# EasyEDA schematic SCH_usb_hub_2024-06-24.json
TITLE: Sheet_1; REV: 1.0; Date: 2024-06-23; Sheet: 1/1; Drawn By: s_nguyen080; Company: Your Company
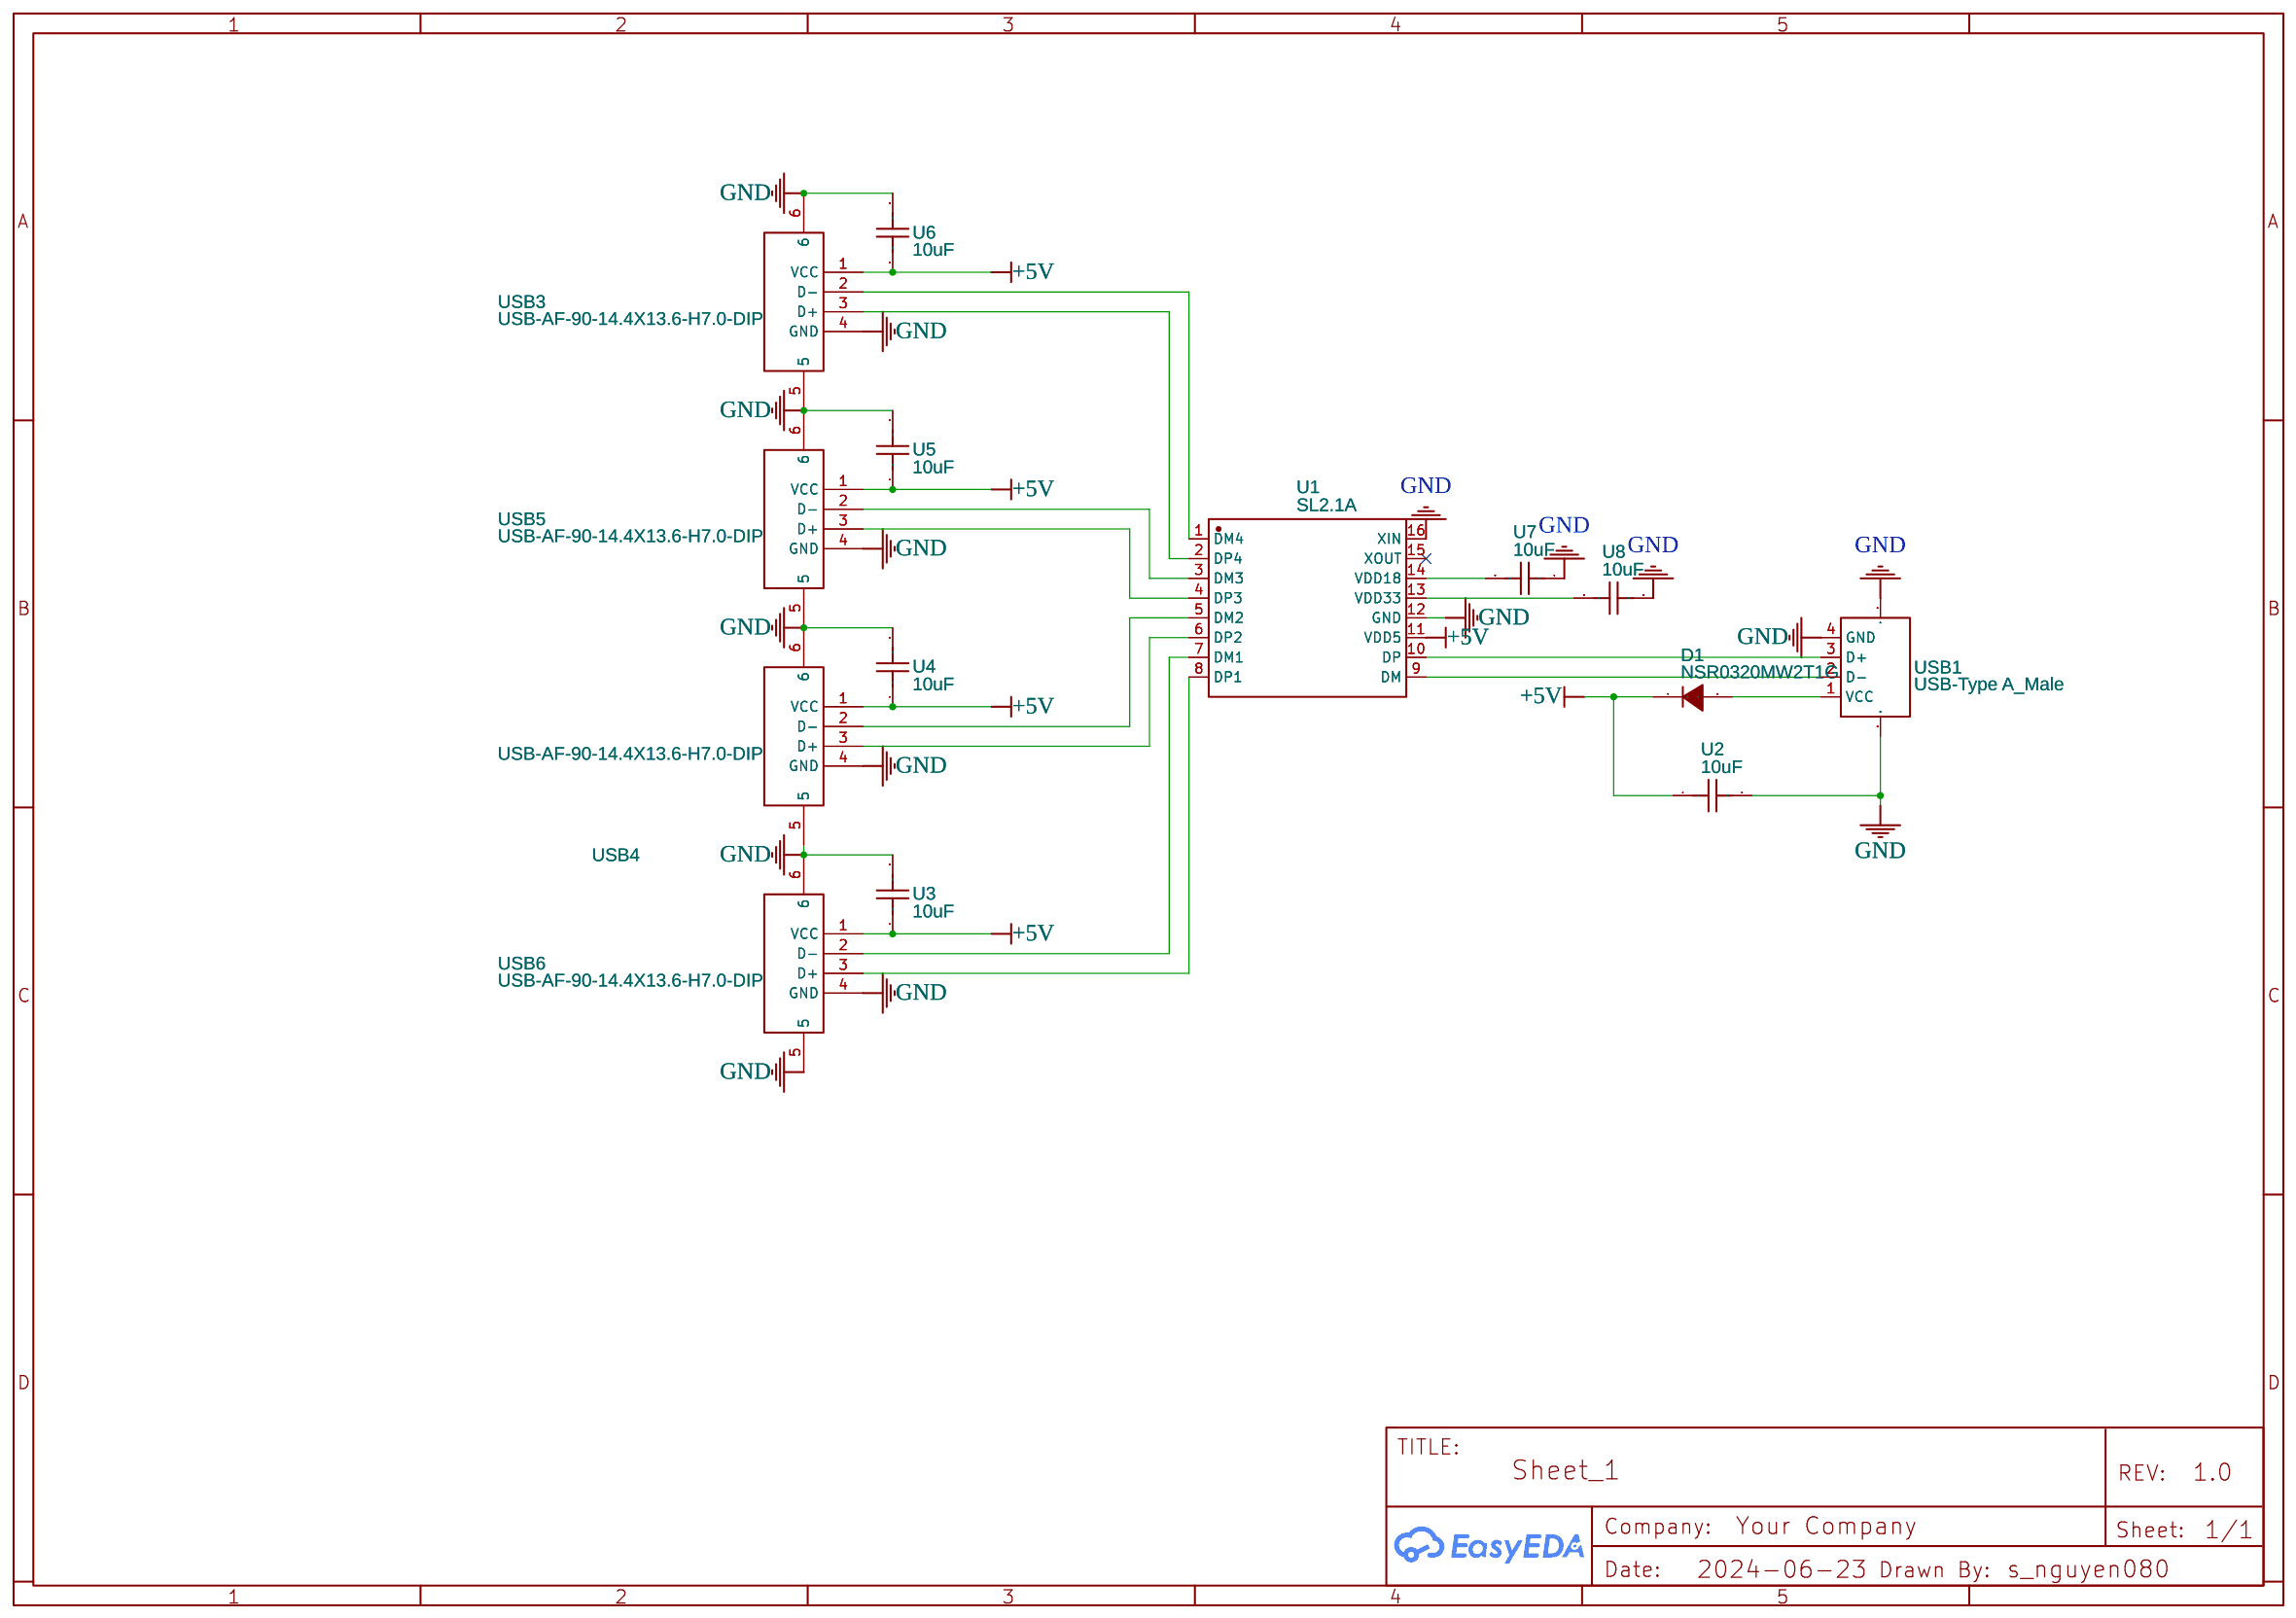
[diagram p0: schematic sheet]

## Parts
D1  NSR0320MW2T1G  [SOD-323_L1.8-W1.3-LS2.5-RD]
U1  SL2.1A  [SOP-16_L10.0-W3.9-P1.27-LS6.0-BL]
U2  10uF  [C0603]
U3  10uF  [C0603]
U4  10uF  [C0603]
U5  10uF  [C0603]
U6  10uF  [C0603]
U7  10uF  [C0603]
U8  10uF  [C0603]
USB1  USB-Type A_Male  [USB-A-TH_48037-0001]
USB3  USB-AF-90-14.4X13.6-H7.0-DIP  [USB-A-TH_C46407]
USB4  USB-AF-90-14.4X13.6-H7.0-DIP  [USB-A-TH_C46407]
USB5  USB-AF-90-14.4X13.6-H7.0-DIP  [USB-A-TH_C46407]
USB6  USB-AF-90-14.4X13.6-H7.0-DIP  [USB-A-TH_C46407]

## Library data of the parts
D1 = NSR0320MW2T1G: Supplier: LCSC; Manufacturer: onsemi(安森美); Supplier Part: C48192; JLCPCB Part Class: Extended Part
U1 = SL2.1A: Contributor: LCSC; Supplier: LCSC; Supplier Part: C192893; Manufacturer: CoreChips(和芯润德); JLCPCB Part Class: Extended Part
U2-U8 = 0603X106K100CT: Contributor: LCSC; Supplier: LCSC; Supplier Part: C2840513; Manufacturer: Walsin(华新科); JLCPCB Part Class: Extended Part
USB1 = USB-Type A_Male: Supplier Part: C112454; Supplier: LCSC; Manufacturer: SOFNG; Manufacturer Part: USB-05; Contributor: LCEDA_Lib
USB3-USB6 = USB-AF-90-14.4X13.6-H7.0-DIP: Contributor: LCSC; Supplier: LCSC; Supplier Part: C46407; Manufacturer: 精拓金; Manufacturer Part: 903-131A1011D10100; JLCPCB Part Class: Extended Part

## Nets
+5V: D1.1(C) U1.11(VDD5) U2.1 U3.1 U4.1 U5.1 U6.1 USB3.1(VCC) USB4.1(VCC) USB5.1(VCC) USB6.1(VCC)
GND: U1.12(GND) U1.16(XIN) U2.2 U3.2 U4.2 U5.2 U6.2 U7.1 U8.2 USB1.4(GND) USB1.5 USB1.6 USB3.4(GND) USB3.5 USB3.6 USB4.4(GND) USB4.5 USB4.6 USB5.4(GND) USB5.5 USB5.6 USB6.4(GND) USB6.5 USB6.6
Net-(D1-2): D1.2(A) USB1.1(VCC)
Net-(U1-1): U1.1(DM4) USB3.2(D-)
Net-(U1-2): U1.2(DP4) USB3.3(D+)
Net-(U1-3): U1.3(DM3) USB5.2(D-)
Net-(U1-4): U1.4(DP3) USB5.3(D+)
Net-(U1-5): U1.5(DM2) USB4.2(D-)
Net-(U1-6): U1.6(DP2) USB4.3(D+)
Net-(U1-7): U1.7(DM1) USB6.2(D-)
Net-(U1-8): U1.8(DP1) USB6.3(D+)
Net-(U1-9): U1.9(DM) USB1.2(D-)
Net-(U1-10): U1.10(DP) USB1.3(D+)
Net-(U1-13): U1.13(VDD33) U8.1
Net-(U1-14): U1.14(VDD18) U7.2

Not connected (* = marked no-connect by the designer): U1 15(XOUT)*
